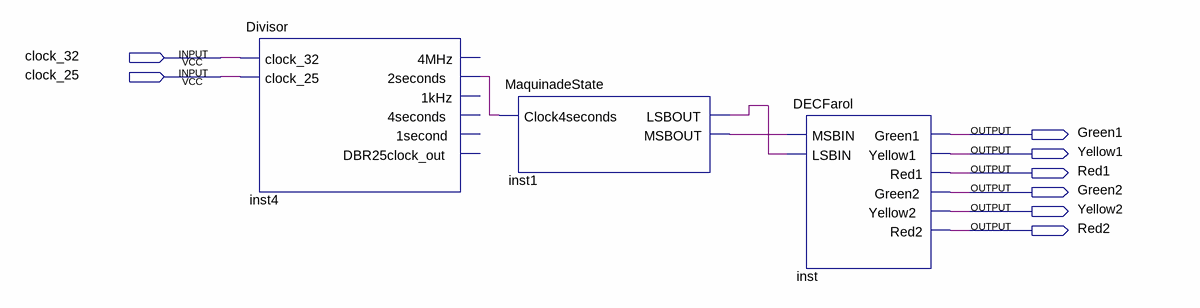
[diagram p0: schematic sheet]
// Quartus schematic MetaFarol.bdf as structural Verilog: 3 symbols, 8 pins
module MetaFarol (
  input  clock_32,
  input  clock_25,
  output Green1,
  output Yellow1,
  output Red1,
  output Green2,
  output Yellow2,
  output Red2
);

  wire inst1_lsbout, inst1_msbout, inst4_2seconds;

  Divisor inst4 (
    .clock_32(clock_32), .clock_25(clock_25), .\2seconds (inst4_2seconds));  // open: 4MHz, 1kHz, 4seconds, 1second, DBR25clock_out
  MaquinadeState inst1 (.Clock4seconds(inst4_2seconds), .LSBOUT(inst1_lsbout), .MSBOUT(inst1_msbout));
  DECFarol inst (
    .MSBIN(inst1_msbout), .LSBIN(inst1_lsbout), .Green1(Green1), .Yellow1(Yellow1), .Red1(Red1),
    .Green2(Green2), .Yellow2(Yellow2), .Red2(Red2));
endmodule
